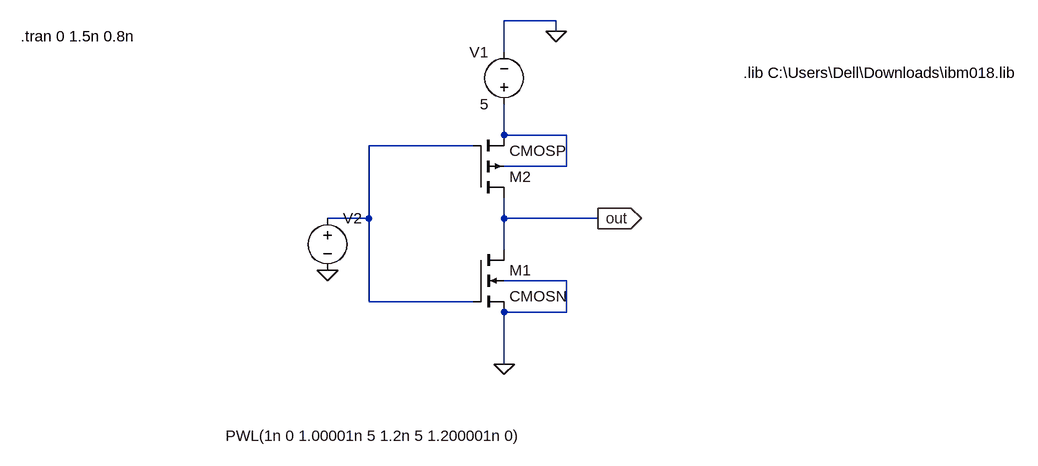
[diagram p0: schematic Schematic.asc]
Schematic.asc, the LTspice schematic file:
Version 4
SHEET 1 1756 1296
WIRE 432 64 352 64
WIRE 432 80 432 64
WIRE 352 112 352 64
WIRE 352 240 352 192
WIRE 448 240 352 240
WIRE 304 256 144 256
WIRE 448 288 448 240
WIRE 448 288 352 288
WIRE 144 368 144 256
WIRE 144 368 80 368
WIRE 352 368 352 336
WIRE 496 368 352 368
WIRE 352 416 352 368
WIRE 448 464 352 464
WIRE 144 496 144 368
WIRE 304 496 144 496
WIRE 448 512 448 464
WIRE 448 512 352 512
WIRE 352 592 352 512
FLAG 432 80 0
FLAG 352 592 0
FLAG 496 368 out
IOPIN 496 368 Out
FLAG 80 448 0
SYMBOL nmos4 304 416 R0
SYMATTR InstName M1
SYMATTR Value CMOSN
SYMATTR Value2 l=1000n w=250n
SYMBOL pmos4 304 336 M180
SYMATTR InstName M2
SYMATTR Value CMOSP
SYMATTR Value2 l=1000n w=518.4n
SYMBOL voltage 352 208 R180
WINDOW 0 24 96 Left 2
WINDOW 3 24 16 Left 2
WINDOW 123 0 0 Left 0
WINDOW 39 0 0 Left 0
SYMATTR InstName V1
SYMATTR Value 5
SYMBOL voltage 80 352 R0
WINDOW 3 -157 350 Left 2
WINDOW 123 0 0 Left 0
WINDOW 39 0 0 Left 0
SYMATTR InstName V2
SYMATTR Value PWL(1n 0 1.00001n 5 1.2n 5 1.200001n 0)
TEXT -392 88 Left 2 !.tran 0 1.5n 0.8n
TEXT 720 144 Left 2 !.lib C:\\Users\\Dell\\Downloads\\ibm018.lib

The netlist it stands for:
* Schematic.asc
M1 out N002 0 0 CMOSN l=1000n w=250n
M2 out N002 N001 N001 CMOSP l=1000n w=518.4n
V1 N001 0 5
V2 N002 0 PWL(1n 0 1.00001n 5 1.2n 5 1.200001n 0)
.model NMOS NMOS
.model PMOS PMOS
.lib standard.mos
.tran 0 1.5n 0.8n
.lib C:\Users\Dell\Downloads\ibm018.lib
.backanno
.end